# Altium project MOD-COIL-LN2-21.PrjPCB (part 3 of 4)

## Sheet Power_Stage.SchDoc: Power Stage
size A3; Author: M.Beldyga; CompanyName: WUT ISE; DrawnBy: M.Beldyga; Organization: WUT ISE; Address1: PW ISE; Address2: Nowowiejska 15/19 00-665 Warsaw; Address3: micbeldyga@gmail.com; SheetNumber: 6; SheetTotal: 9; ModifiedBy: -; CheckedDate: -; DivGrp: WUT ISE; Designer: GK, MB; ModifiedDate: -; ProjectName: Sensor Box
Used 2 times, as channels U_Power_Stage, U_Power_Stage. Parts and nets are listed once, with the designators drawn on the sheet.
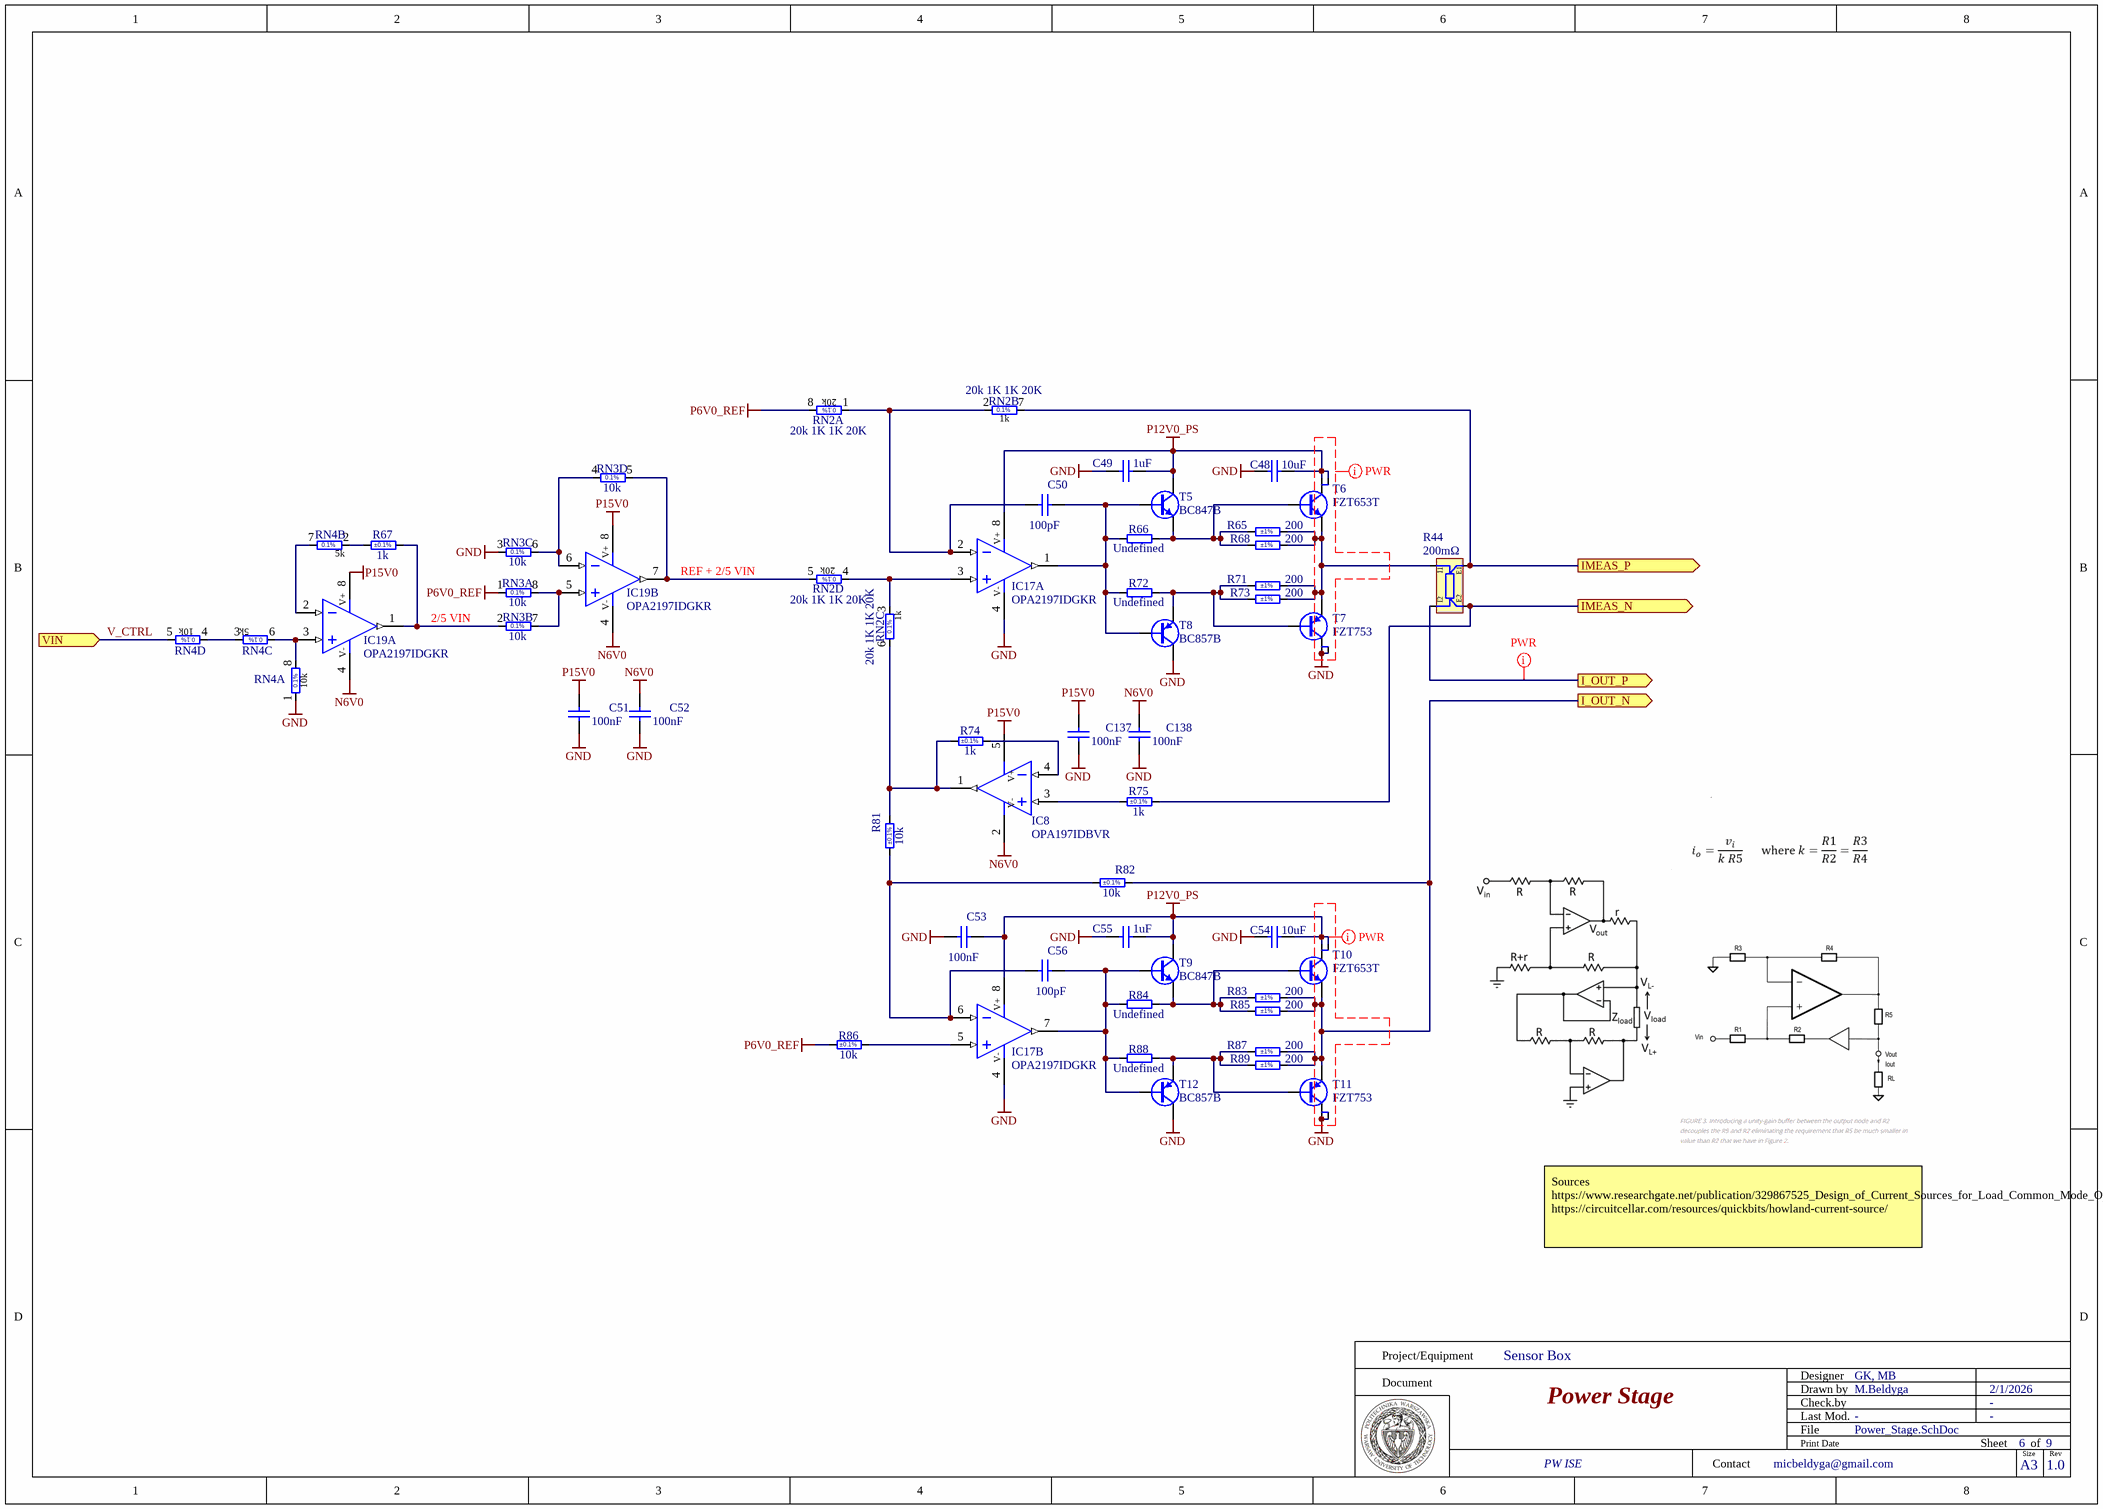
[diagram p5: Power_Stage.SchDoc]

### Parts
C48  10uF  [CAPC2012X95N]
C49  1uF  [CAPC1608X87N]
C50  100pF  [CAPC1005X55N]
C51  100nF  [CAPC1005X55N]
C52  100nF  [CAPC1005X55N]
C53  100nF  [CAPC1005X55N]
C54  10uF  [CAPC2012X95N]
C55  1uF  [CAPC1608X87N]
C56  100pF  [CAPC1005X55N]
C137  100nF  [CAPC1005X55N]
C138  100nF  [CAPC1005X55N]
IC8  OPA197IDBVR  [SOT95P280X145-5N]
IC17  OPA2197IDGKR  [SOP65P490X110-8N]  (parts A,B of 2)
IC19  OPA2197IDGKR  [SOP65P490X110-8N]  (parts A,B of 2)
R44  200mΩ  [RES_VISHAY_CSM2512_0R007-0R2]
R65  200  Tolerance: ±1%  [RESC1608X55N]
R66  Undefined  [RESC1608X55N]
R67  1k  Tolerance: ±0.1%  [RESC1005X40N]
R68  200  Tolerance: ±1%  [RESC1608X55N]
R71  200  Tolerance: ±1%  [RESC1608X55N]
R72  Undefined  [RESC1608X55N]
R73  200  Tolerance: ±1%  [RESC1608X55N]
R74  1k  Tolerance: ±0.1%  [RESC1005X40N]
R75  1k  Tolerance: ±0.1%  [RESC1005X40N]
R81  10k  Tolerance: ±0.1%  [RESC1005X35N]
R82  10k  Tolerance: ±0.1%  [RESC1005X35N]
R83  200  Tolerance: ±1%  [RESC1608X55N]
R84  Undefined  [RESC1608X55N]
R85  200  Tolerance: ±1%  [RESC1608X55N]
R86  10k  Tolerance: ±0.1%  [RESC1005X35N]
R87  200  Tolerance: ±1%  [RESC1608X55N]
R88  Undefined  [RESC1608X55N]
R89  200  Tolerance: ±1%  [RESC1608X55N]
RN2  20k 1K 1K 20K  [SOIC127P600X175-8N]  (parts A,B,C,D of 4)
RN3  10k  [SOIC127P600X175-8N]  (parts A,B,C,D of 4)
RN4  10k 5K 5K 10K  [SOIC127P600X175-8N]  (value not drawn)  (parts A,B,C,D of 4)
T5  BC847B  [SOT95P230X110-3N]
T6  FZT653T  [SOT230P700X180-4N]
T7  FZT753  [SOT230P700X180-4N]
T8  BC857B  [SOT95P230X110-3N]
T9  BC847B  [SOT95P230X110-3N]
T10  FZT653T  [SOT230P700X180-4N]
T11  FZT753  [SOT230P700X180-4N]
T12  BC857B  [SOT95P230X110-3N]

### Ports
I_OUT_N (out), I_OUT_P (out), IMEAS_N (out), IMEAS_P (out), VIN (in)

### Nets
GND: C48.2 C49.1 C51.1 C52.1 C53.1 C54.2 C55.1 C137.1 C138.1 IC17.4(V-) RN3.3 RN4.1 T7.2(C) T7.4(C) T8.3(C) T11.2(C) T11.4(C) T12.3(C)
N6V0: C52.2 C138.2 IC8.2(V-) IC19.4(V-)
P6V0_REF: R86.1 RN2.8 RN3.1
P12V0_PS: C48.1 C49.2 C53.2 C54.1 C55.2 IC17.8(V+) T5.3(C) T6.2(C) T6.4(C) T9.3(C) T10.2(C) T10.4(C)
P15V0: C51.2 C137.2 IC8.5(V+) IC19.8(V+)
I_OUT_N: R82.2 R83.2 R85.2 R87.2 R89.2 T10.3(E) T11.3(E) ; port I_OUT_N
I_OUT_P: R44.I2 ; port I_OUT_P
IMEAS_N: R44.E2 R75.2 ; port IMEAS_N
IMEAS_P: R44.E1 RN2.7 ; port IMEAS_P
V_CTRL: RN4.5 ; port VIN
NetC50_1: C50.1 IC17.2(IN-) RN2.1 RN2.2
NetC50_2: C50.2 IC17.1(OUT) R66.1 R72.1 T5.1(B) T8.1(B)
NetC56_1: C56.1 IC17.6(IN-) R81.1 R82.1
NetC56_2: C56.2 IC17.7(OUT) R84.1 R88.1 T9.1(B) T12.1(B)
NetIC8_1: IC8.1(OUT) R74.1 R81.2 RN2.6
NetIC8_3: IC8.3(IN+) R75.1
NetIC8_4: IC8.4(IN-) R74.2
NetIC17_3: IC17.3(IN+) RN2.3 RN2.4
NetIC17_5: IC17.5(IN+) R86.2
NetIC19_1: IC19.1(OUT) R67.2 RN3.2
NetIC19_2: IC19.2(IN-) RN4.7
NetIC19_3: IC19.3(IN+) RN4.6 RN4.8
NetIC19_5: IC19.5(IN+) RN3.7 RN3.8
NetIC19_6: IC19.6(IN-) RN3.4 RN3.6
NetIC19_7: IC19.7(OUT) RN2.5 RN3.5
NetR44_I1: R44.I1 R65.2 R68.2 R71.2 R73.2 T6.3(E) T7.3(E)
NetR65_1: R65.1 R66.2 R68.1 T5.2(E) T6.1(B)
NetR67_1: R67.1 RN4.2
NetR71_1: R71.1 R72.2 R73.1 T7.1(B) T8.2(E)
NetR83_1: R83.1 R84.2 R85.1 T9.2(E) T10.1(B)
NetR87_1: R87.1 R88.2 R89.1 T11.1(B) T12.2(E)
NetRN4_3: RN4.3 RN4.4

### Channels
U_Power_Stage: designators end in A; ports I_OUT_N=CH0_OUT_N I_OUT_P=CH0_OUT_P IMEAS_N=CH0_IMEAS_N IMEAS_P=CH0_IMEAS_P VIN=V_CTRL
U_Power_Stage: designators end in B; ports I_OUT_N=CH1_OUT_N I_OUT_P=CH1_OUT_P IMEAS_N=CH1_IMEAS_N IMEAS_P=CH1_IMEAS_P VIN=V_CTRL

### Layout directives
net class PWR: CH0_OUT_P, GND, P12V0_PS

### Notes on the sheet
- REF + 2/5 VIN
- (near RN3) 2/5 VIN
- Sources https://www.researchgate.net/publication/329867525_Design_of_Current_Sources_for_Load_Common_Mode_Optimization/figures?lo=1
  https://circuitcellar.com/resources/quickbits/howland-current-source/
- Project/Equipment
- Document
- Designer
- Drawn by
- Check.by
- Contact
- File
- Last Mod.
- Print Date
- Sheet
- Size
- A3
- of
- Rev
- (in symbol RN_10K_5K_VISHAY_AORN2-1AT3, part A) 10k
- (in symbol RN_10K_5K_VISHAY_AORN2-1AT3, part B) 5k
- (in symbol RN_10K_5K_VISHAY_AORN2-1AT3, part C) 5k
- (in symbol RN_10K_5K_VISHAY_AORN2-1AT3, part D) 10k
- (in symbol RN_20K_1K_VISHAY_AORN20-1A, part A) 20k
- (in symbol RN_20K_1K_VISHAY_AORN20-1A, part B) 1k
- (in symbol RN_20K_1K_VISHAY_AORN20-1A, part C) 1k
- (in symbol RN_20K_1K_VISHAY_AORN20-1A, part D) 20k

### Library data of the parts
C48 C54 = CC0805_10UF_25V_10%_X5R: Non-polarised capacitor; Part Description: SMD Multilayer Chip Ceramic Capacitor; Manufacturer: GENERIC; Manufacturer1 Part Number: GRM21BR61E106KA73L; Voltage: 25V; TC: X5R; Tolerance: ±10%; Part Number: CC0805_10UF_25V_10%_X5R; Component Kind: Standard; Component Type: Standard; Pin Count: 2; Value: 10uF; Status: Preferred; Manufacturer Part Number: CC0805_10UF_25V_10%_X5R; Case: 0805; Mounted: Yes; Socket: No; SMD: Yes; Sense: No; Manufacturer1 Example: MURATA; Manufacturer1 ComponentHeight: 0.95mm; HelpURL: \\cern.ch\dfs\Applications\Altium\Datasheets\CC0805_X5R_MURATA_GRM.pdf; Author: CERN DEM JLC; CreateDate: 25.10.2012; LatestRevisionDate: 06.09.2016
C49 C55 = CC0603_1UF_25V_10%_X7R: Non-polarised capacitor; Part Description: SMD Multilayer Chip Ceramic Capacitor; Manufacturer: GENERIC; Manufacturer1 Part Number: GCM188R71E105KA64D; Voltage: 25V; TC: X7R; Tolerance: ±10%; Part Number: CC0603_1UF_25V_10%_X7R; Component Kind: Standard; Component Type: Standard; Pin Count: 2; Value: 1uF; Status: None; Manufacturer Part Number: CC0603_1UF_25V_10%_X7R; Case: 0603; Mounted: Yes; Socket: No; SMD: Yes; Sense: No; Manufacturer1 Example: MURATA; Manufacturer1 ComponentHeight: 0.9mm; HelpURL: \\cern.ch\dfs\Applications\Altium\Datasheets\CC0603_X7R_MURATA.pdf; Author: CERN DEM JLC; CreateDate: 18.01.2011; LatestRevisionDate: 18.01.2011
C50 C56 = CC0402_100PF_50V_5%_C0G: Non-polarised capacitor; Part Description: SMD Multilayer Chip Ceramic Capacitor; Manufacturer: GENERIC; Manufacturer1 Part Number: C0402C101J5GACTU; Voltage: 50V; TC: C0G/NP0; Tolerance: ±5%; Part Number: CC0402_100PF_50V_5%_C0G; Component Kind: Standard; Component Type: Standard; Pin Count: 2; Value: 100pF; Status: Preferred; Manufacturer Part Number: CC0402_100PF_50V_5%_C0G; Case: 0402; Mounted: Yes; Socket: No; SMD: Yes; Sense: No; Manufacturer1 Example: KEMET; Manufacturer1 ComponentHeight: 0.55mm; HelpURL: \\cern.ch\dfs\Applications\Altium\Datasheets\CC0402_C0G_KEMET_(Commercial Grade).pdf; Author: CERN DEM JLC; CreateDate: 12/3/2007; LatestRevisionDate: 4/22/2015
C51-C53 C137 C138 = CC0402_100NF_16V_10%_X5R: Non-polarised capacitor; Part Description: SMD Multilayer Chip Ceramic Capacitor; Manufacturer: GENERIC; Manufacturer1 Part Number: GRM155R61C104KA88D; Voltage: 16V; TC: X5R; Tolerance: ±10%; Part Number: CC0402_100NF_16V_10%_X5R; Component Kind: Standard; Component Type: Standard; Pin Count: 2; Value: 100nF; Status: None; Manufacturer Part Number: CC0402_100NF_16V_10%_X5R; Case: 0402; Mounted: Yes; Socket: No; SMD: Yes; Sense: No; Manufacturer1 Example: MURATA; Manufacturer1 ComponentHeight: 0.55mm; HelpURL: \\cern.ch\dfs\Applications\Altium\Datasheets\CC0402_X5R_MURATA_GRM.pdf; Author: CERN DEM JLC; CreateDate: 10.12.2013; LatestRevisionDate: 10.12.2013
IC8 = OPA197IDBVR: Op Amp Single Precision Amplifier R-R I/O ±18V/36V 5-Pin SOT-23 T/R; Manufacturer: Texas Instruments; Manufacturer Lifecycle Status: ACTIVE; Gain Bandwidth Product: 10MHz; Input Bias Current: 5pA; Input Offset Voltage (Vos): 25µV; Number of Channels: 1; Operating Supply Current: 1mA; Output Current per Channel: 65mA; Slew Rate: 20V/µs; Supplier: DigiKey; Supplier Part Number: 296-47813-6-ND; Manufacturer Part Number: OPA197IDBVR; RoHS: Compliant; Category: Amplifiers - Op Amps, Buffer, Instrumentation; Pricing: 1=1.71, 10=1.254, 25=1.1404, 100=1.0149, 250=0.95512, 500=0.9191, 1000=0.88942 (USD); Case/Package: SOT-23; Height: 1.45mm; Lead Free: Lead Free; Length: 2.9mm; Lifecycle Status: Production; Max Operating Temperature: 125°C; Min Operating Temperature: -40°C; Mounting Technology: Surface Mount; Number of Circuits: 1; Pins: 5; Schedule B: 8542330000, 8542330000|8542330000|8542330000|8542330000|8542330000|8542330000|8542330000|8542330000|8542330000|8542330000|8542330000|8542330000|8542330000|8542330000|8542330000|8542330000|8542330000|8542330000|8542330000|8542330000|8542330000|8542330000|8542330000|85; Thickness: 1.2mm; Width: 1.6mm; ComponentLink1URL: https://sigma.octopart.com:443/177332311/technical_drawing/Texas-Instruments-OPA197IDBVR.pdf?src-supplier=Texas+Instruments; ComponentLink1Description: https://sigma.octopart.com:443/177332311/technical_drawing/Texas-Instruments-OPA197IDBVR.pdf?src-supplier=Texas+Instruments; ComponentLink2URL: https://octopart.com:443/opatz8j6/c1?t=Q1P8Bdc4KgCCbFqp7UlYpcJ8AhpVpiPIEDSj71pxBcZVcsUhmuEmpKuLfuswML2SqYTIjZ0KbZTePt0BTa5L0Ib-QO4qx2Pc4AGXPK19iWgmTvAzROBybWvsv8SVdmbKXcfVjzYF5gNG51bfmeDdyG8TPrSMEhnU0XxyolWqRvFZRm1lt3I32W7t_wfMxmeR34edfRjLHyyRFXxPyflRs4eg4WP07F8bmt6pOKmN-USMuy6Faze7x22RpNONDH4EojWIvEjwq6_wS8mD7vZGVP7z7Ngk7vArTcyRg02zIl199DZ1b6QvO1RGY5iVnJ8IHDniUbpBX1tObbv_cSSRQlS6KVLtLLjRXr4EmXhu9GKtw9wXk68tfrl34suuqK6ened5hg&src-supplier=Texas+Instruments; ComponentLink2Description: https://octopart.com:443/opatz8j6/c1?t=Q1P8Bdc4KgCCbFqp7UlYpcJ8AhpVpiPIEDSj71pxBcZVcsUhmuEmpKuLfuswML2SqYTIjZ0KbZTePt0BTa5L0Ib-QO4qx2Pc4AGXPK19iWgmTvAzROBybWvsv8SVdmbKXcfVjzYF5gNG51bfmeDdyG8TPrSMEhnU0XxyolWqRvFZRm1lt3I32W7t_wfMxmeR34edfRjLHyyRFXxPyflRs4eg4WP07F8bmt6pOKmN-USMuy6Faze7x22RpNONDH4EojWIvEjwq6_wS8mD7vZGVP7z7Ngk7vArTcyRg02zIl199DZ1b6QvO1RGY5iVnJ8IHDniUbpBX1tObbv_cSSRQlS6KVLtLLjRXr4EmXhu9GKtw9wXk68tfrl34suuqK6ened5hg&src-supplier=Texas+Instruments; ComponentLink3URL: https://sigma.octopart.com:443/175570406/technical_drawing/Texas-Instruments-OPA197IDBVR.pdf?src-supplier=Texas+Instruments; ComponentLink3Description: https://sigma.octopart.com:443/175570406/technical_drawing/Texas-Instruments-OPA197IDBVR.pdf?src-supplier=Texas+Instruments; ComponentLink4URL: https://sigma.octopart.com:443/169406034/technical_drawing/Texas-Instruments-OPA197IDBVR.pdf?src-supplier=Texas+Instruments; ComponentLink4Description: https://sigma.octopart.com:443/169406034/technical_drawing/Texas-Instruments-OPA197IDBVR.pdf?src-supplier=Texas+Instruments; ComponentLink5URL: https://sigma.octopart.com:443/155939316/technical_drawing/Texas-Instruments-OPA197IDBVR.pdf?src-supplier=Texas+Instruments; ComponentLink5Description: https://sigma.octopart.com:443/155939316/technical_drawing/Texas-Instruments-OPA197IDBVR.pdf?src-supplier=Texas+Instruments; ComponentLink6URL: https://sigma.octopart.com:443/102331370/technical_drawing/Texas-Instruments-OPA197IDBVR.pdf?src-supplier=Texas+Instruments; ComponentLink6Description: https://sigma.octopart.com:443/102331370/technical_drawing/Texas-Instruments-OPA197IDBVR.pdf?src-supplier=Texas+Instruments; ComponentLink7URL: https://datasheet.octopart.com:443/OPA197IDBVR-Texas-Instruments-datasheet-62062805.pdf?src-supplier=Texas+Instruments; ComponentLink7Description: https://datasheet.octopart.com:443/OPA197IDBVR-Texas-Instruments-datasheet-62062805.pdf?src-supplier=Texas+Instruments; ComponentLink8URL: https://sigma.octopart.com:443/49249325/technical_drawing/Texas-Instruments-OPA197IDBVR.pdf?src-supplier=Texas+Instruments; ComponentLink8Description: https://sigma.octopart.com:443/49249325/technical_drawing/Texas-Instruments-OPA197IDBVR.pdf?src-supplier=Texas+Instruments; ComponentLink9URL: https://datasheet.octopart.com:443/OPA197IDBVR-Texas-Instruments-datasheet-164361763.pdf?src-supplier=SHENGYU+ELECTRONICS; ComponentLink9Description: https://datasheet.octopart.com:443/OPA197IDBVR-Texas-Instruments-datasheet-164361763.pdf?src-supplier=SHENGYU+ELECTRONICS; ComponentLink10URL: https://datasheet.octopart.com:443/OPA197IDBVR-Texas-Instruments-datasheet-165804228.pdf?src-supplier=LCSC; ComponentLink10Description: https://datasheet.octopart.com:443/OPA197IDBVR-Texas-Instruments-datasheet-165804228.pdf?src-supplier=LCSC; ComponentLink11URL: https://datasheet.octopart.com:443/OPA197IDBVR-Texas-Instruments-datasheet-159115560.pdf?src-supplier=LCSC; ComponentLink11Description: https://datasheet.octopart.com:443/OPA197IDBVR-Texas-Instruments-datasheet-159115560.pdf?src-supplier=LCSC; ComponentLink12URL: https://datasheet.octopart.com:443/OPA197IDBVR-Texas-Instruments-datasheet-140571582.pdf?src-supplier=Arrow.cn; ComponentLink12Description: https://datasheet.octopart.com:443/OPA197IDBVR-Texas-Instruments-datasheet-140571582.pdf?src-supplier=Arrow.cn; ComponentLink13URL: https://datasheet.octopart.com:443/OPA197IDBVR-Texas-Instruments-datasheet-137316104.pdf?src-supplier=Future+Electronics; ComponentLink13Description: https://datasheet.octopart.com:443/OPA197IDBVR-Texas-Instruments-datasheet-137316104.pdf?src-supplier=Future+Electronics; ComponentLink14URL: http://sigma.octopart.com:80/reach_statement/Texas-Instruments-company-64.pdf?src-supplier=Compliance+Statements; ComponentLink14Description: http://sigma.octopart.com:80/reach_statement/Texas-Instruments-company-64.pdf?src-supplier=Compliance+Statements; ComponentLink15URL: http://sigma.octopart.com:80/conflict_mineral_statement/Texas-Instruments-company-63.pdf?src-supplier=Compliance+Statements; ComponentLink15Description: http://sigma.octopart.com:80/conflict_mineral_statement/Texas-Instruments-company-63.pdf?src-supplier=Compliance+Statements
IC17 IC19 = OA_OPA2197IDGKR: 36-V, Precision, Rail-to-Rail Input Output, Low Offset Voltage Op Amp 8-VSSOP; Part Description: High-Precision, Low-Noise, Rail-to-Rail Output,10-MHz Op Amp; Manufacturer1: TEXAS INSTRUMENTS; PressFit: No; Bonding: No; Part Number: OPA2197IDGKR; Component Kind: Standard; Component Type: Standard; Device: OPA2197IDGKR; PackageDescription: SOP, 0.65mm pitch; 8 pin, 3.00mm W X 3.00mm L X 1.10mm H body, IPC Medium Density; Manufacturer1 Part Number: OPA2197IDGKR; Pin Count: 8; Case: MSOP8; Mounted: Yes; Socket: No; SMD: Yes; Sense: No; ComponentHeight: 1.1mm; Author: GK; HelpURL: \\cern.ch\dfs\Applications\Altium\Datasheets\OPA2140AIDGK.pdf; CreateDate: 20.04.2017; LatestRevisionDate: 20.04.2017
R44 = Y14870R20000B9R: Fixed Resistor, Metal Strip, 1W, 0.2ohm, 0.447V, 0.1% +/-Tol, 15ppm/Cel, Surface Mount, 2512; Manufacturer: VPG Foil Resistors; Temperature Coefficient: 15ppm/°C; Working Voltage: 447mV; Supplier: DigiKey; Supplier Part Number: 804-Y14870R20000B9RCT-ND; Manufacturer Part Number: Y14870R20000B9R; RoHS: Compliant; Category: Chip SMD Resistors; Stock: 1352; Pricing: 1=12.8, 10=8.918, 25=7.8692, 50=7.2126, 100=6.6548, 250=6.25768 (USD); Case/Package: 2512; Case Code (Imperial): 2512; Case Code (Metric): 6432; Composition: Metal Foil; Features: Moisture Resistant; Height: 635µm; Length: 6.35mm; Lifecycle Status: Production; Max Operating Temperature: 170°C; Max Power Dissipation: 1W; Min Operating Temperature: -65°C; Mounting Technology: Surface Mount; Number of Terminals: 2; Number of Terminations: 4; Packaging: Tape & Reel (TR); Power Dissipation: 1W; REACH SVHC: Yes; Value: 200mΩ; Tolerance: 0.1%; Width: 3.175mm; ComponentLink1URL: https://datasheet.octopart.com:443/Y14870R20000B9R-Vishay-Precision-Group-datasheet-182188787.pdf?src-supplier=IHS; ComponentLink1Description: https://datasheet.octopart.com:443/Y14870R20000B9R-Vishay-Precision-Group-datasheet-182188787.pdf?src-supplier=IHS; ComponentLink2URL: https://datasheet.octopart.com:443/Y14870R20000B9R-VPG-Foil-Resistors-datasheet-182027518.pdf?src-supplier=IHS; ComponentLink2Description: https://datasheet.octopart.com:443/Y14870R20000B9R-VPG-Foil-Resistors-datasheet-182027518.pdf?src-supplier=IHS
R65 R68 R71 R73 R83 R85 R87 R89 = R0603_200R_1%_0.1W_100PPM: Resistor - 1%; Part Description: General Purpose Thick Film Chip Resistor; Manufacturer: GENERIC; Manufacturer1: Vishay; Manufacturer1 Part Number: CRCW0603200RFKEA; Power: 0.1W; TC: ±100ppm/°C; PressFit: No; Part Number: R0603_200R_1%_0.1W_100PPM; Component Kind: Standard; Component Type: Standard; Pin Count: 2; Value: 200; Status: Preferred; Manufacturer Part Number: R0603_200R_1%_0.1W_100PPM; Case: 0603; Mounted: Yes; Sense: No; Socket: No; SMD: Yes; Manufacturer1 ComponentHeight: 0.55mm; HelpURL: \\cern.ch\dfs\Applications\Altium\Datasheets\R0603_NIC_NRC.pdf; Author: CERN DEM JLC; CreateDate: 03.12.2007; LatestRevisionDate: 13.03.2008
R66 R72 R84 R88 = R0603_NO-VALUE: Resistor; Part Description: Reserved Footprint For a 0603 (1608) Chip Resistor; PressFit: No; Mounted: No; Part Number: R0603_NO-VALUE; Component Kind: Standard; Component Type: Standard; Pin Count: 2; Value: Undefined; Status: None; Manufacturer: Undefined; Manufacturer Part Number: R0603_NO-VALUE; Case: 0603; Sense: No; Socket: No; SMD: Yes; Manufacturer1 Example: Undefined; Manufacturer1 Part Number: Undefined; Manufacturer1 ComponentHeight: Undefined; HelpURL: Undefined; Author: CERN DEM JLC; CreateDate: 03.12.2007; LatestRevisionDate: 13.03.2008
R67 R74 R75 = R0402_1K_0.1%_0.063W_25PPM: Resistor - 0.1%; Part Description: Thin Film Precision Resistor; Manufacturer: GENERIC; Manufacturer1 Part Number: ERA2AEB102X; Power: 0.063W; TC: ±25ppm/°C; PressFit: No; Voltage: 50V; Part Number: R0402_1K_0.1%_0.063W_25PPM; Component Kind: Standard; Component Type: Standard; Pin Count: 2; Value: 1k; Status: Not Recommended; Manufacturer Part Number: R0402_1K_0.1%_0.063W_25PPM; Case: 0402; Mounted: Yes; Sense: No; Socket: No; SMD: Yes; Manufacturer1 ComponentHeight: 0.4mm; HelpURL: \\cern.ch\dfs\Applications\Altium\Datasheets\R0402_PANASONIC_ERA.pdf; Author: CERN DEM BC; CreateDate: 7/10/2020; LatestRevisionDate: 7/10/2020; Manufacturer1 Example: PANASONIC
R81 R82 R86 = R0402_10K_0.1%_0.063W_25PPM: Resistor - 0.1%; Part Description: Thin Film Precision Resistor; Manufacturer: GENERIC; Manufacturer1 Part Number: CPF0402B10KE1; Power: 0.063W; TC: ±25ppm/°C; PressFit: No; Part Number: R0402_10K_0.1%_0.063W_25PPM; Component Kind: Standard; Component Type: Standard; Pin Count: 2; Value: 10k; Status: Not Recommended; Manufacturer Part Number: R0402_10K_0.1%_0.063W_25PPM; Case: 0402; Mounted: Yes; Sense: No; Socket: No; SMD: Yes; Manufacturer1 ComponentHeight: 0.35mm; HelpURL: \\cern.ch\dfs\Applications\Altium\Datasheets\R0402_TYCO_CPF.pdf; Author: CERN DEM JMW; CreateDate: 9/22/2015; LatestRevisionDate: 9/22/2015; Manufacturer1 Example: TE CONNECTIVITY
RN2 = RN_20K_1K_VISHAY_AORN20-1A: DIL8 Resistor Network 4 Resistors 4xR 10k-1k-1k-10k 0.1%; Part Number: RN_20K_1K_VISHAY_AORN10-1A; Part Description: Dual-In-Line Thin Film Precision Automotive Resistors Network, (4 Isolated) - AORN Series; Manufacturer1: VISHAY DALE; Manufacturer1 Part Number: AORN20-1AT5; Power: 4x0.1W; TC: ±25ppm/°C; PressFit: No; Component Kind: Standard; Component Type: Standard; Pin Count: 8; Value: 20k 1K 1K 20K; Sense: No; Tolerance: 0.1%; Case: SOIC8; Mounted: Yes; Socket: No; SMD: Yes; ComponentHeight: 1.73mm; HelpURL: \\cern.ch\dfs\Applications\Altium\Datasheets\RN_VISHAY_AORN.pdf; Author: GK; CreateDate: 20.02.2017; LatestRevisionDate: 15.01.2020
RN3 = RN_10K_VISHAY_AORN1002A: DIL8 Resistor Network 4 Isolated Resistor 0.1%; Part Description: Dual-In-Line Thin Film Precision Automotive Resistors Network, (4 Isolated) - AORN Series; Manufacturer1: VISHAY DALE; Manufacturer1 Part Number: AORN1002AT5; Power: 4x0.1W; TC: ±25ppm/°C; PressFit: No; Part Number: RN_10K_VISHAY_AORN1002A; Component Kind: Standard; Component Type: Standard; Pin Count: 8; Value: 10k; Sense: No; Tolerance: 0.1%; Case: SOIC8; Mounted: Yes; Socket: No; SMD: Yes; ComponentHeight: 1.73mm; HelpURL: \\cern.ch\dfs\Applications\Altium\Datasheets\RN_VISHAY_AORN.pdf; Author: CERN DEM JLC; CreateDate: 20.02.2017; LatestRevisionDate: 03.05.2017
RN4 = RN_10K_5K_VISHAY_AORN2-1AT3: DIL8 Resistor Network 4 Resistors 10k-5k-5k-10k 0.1%; Part Description: Dual-In-Line Thin Film Precision Automotive Resistors Network, (4 Isolated) - AORN Series; Manufacturer1: VISHAY DALE; Manufacturer1 Part Number: AORN2-1AT5; Power: 4x0.1W; TC: ±25ppm/°C; PressFit: No; Part Number: RN_10K_5K_VISHAY_AORN2-1AT3; Component Kind: Standard; Component Type: Standard; Pin Count: 8; Value: 10k 5K 5K 10K; Sense: No; Tolerance: 0.1%; Case: SOIC8; Mounted: Yes; Socket: No; SMD: Yes; ComponentHeight: 1.73mm; HelpURL: \\cern.ch\dfs\Applications\Altium\Datasheets\RN_VISHAY_AORN.pdf; Author: CERN DEM JLC; CreateDate: 20.02.2017; LatestRevisionDate: 20.02.2017
T5 T9 = BC847B: NPN Transistor; Part Description: 45V 100mA NPN General-Purpose Transistor; Manufacturer: NXP SEMICONDUCTORS; PressFit: No; Bonding: No; Part Number: BC847B; Component Kind: Standard; Component Type: Standard; Device: BC847B; PackageDescription: SOT23, 0.95mm Pitch; 3 Pin, 1.30mm W X 2.90mm L X 1.10mm H body, IPC Medium Density; Manufacturer Part Number: BC847B; Pin Count: 3; Case: SOT23-3; Mounted: Yes; Socket: No; SMD: Yes; Sense: No; ComponentHeight: 1.1mm; HelpURL: \\cern.ch\dfs\Applications\Altium\Datasheets\BC847B.pdf; Author: CERN DEM JLC; CreateDate: 6/14/2011; LatestRevisionDate: 6/14/2011
T6 T10 = FZT653T: NPN Transistor; Part Description: 60 To 100V, 2A, NPN Silicon Planar Medium Power High gain Transistor; Manufacturer: ZETEX SEMICONDUCTORS; PressFit: No; Bonding: No; Part Number: FZT653T; Component Kind: Standard; Component Type: Standard; Device: FZT653T; PackageDescription: SOT223, 2.30mm Pitch; 4 Pin, 3.70mm W X 6.70mm L X 1.80mm H body, IPC Medium Density; Manufacturer Part Number: FZT653T; Pin Count: 4; Case: SOT223; Mounted: Yes; Socket: No; SMD: Yes; Sense: No; ComponentHeight: 1.8mm; HelpURL: \\cern.ch\dfs\Applications\Altium\Datasheets\FZT653T.pdf; Author: CERN DEM HF; CreateDate: 4/22/2022; LatestRevisionDate: 4/22/2022
T7 T11 = FZT753: PNP Transistor; Part Description: 60V, 5A, PNP Silicon Planar High Current Transistor; Manufacturer: DIODES INCORPORATED; PressFit: No; Bonding: No; Part Number: FZT753; Component Kind: Standard; Component Type: Standard; Device: FZT753; PackageDescription: SOT223, 2.30mm Pitch; 4 Pin, 3.70mm W X 6.70mm L X 1.80mm H body, IPC Medium Density; Manufacturer Part Number: FZT753; Pin Count: 4; Case: SOT223; Mounted: Yes; Socket: No; SMD: Yes; Sense: No; ComponentHeight: 1.8mm; HelpURL: \\cern.ch\dfs\Applications\Altium\Datasheets\FZT753.pdf; Author: CERN DEM JLC; CreateDate: 8/19/2014; LatestRevisionDate: 8/19/2014
T8 T12 = BC857B: PNP Transistor; Part Description: -45V -100mA PNP General-Purpose Transistors; Manufacturer: NXP SEMICONDUCTORS; PressFit: No; Bonding: No; Part Number: BC857B; Component Kind: Standard; Component Type: Standard; Device: BC857B; PackageDescription: SOT23, 0.95mm Pitch; 3 Pin, 1.30mm W X 2.90mm L X 1.10mm H body, IPC Medium Density; Manufacturer Part Number: BC857B; Pin Count: 3; Case: SOT23-3; Mounted: Yes; Socket: No; SMD: Yes; Sense: No; ComponentHeight: 1.1mm; HelpURL: \\cern.ch\dfs\Applications\Altium\Datasheets\BC857B.pdf; Author: CERN DEM JLC; CreateDate: 6/14/2011; LatestRevisionDate: 6/14/2011

## Sheet Booster_con.SchDoc: DisplayPort
size A3; Author: M.Beldyga; CompanyName: WUT ISE; DrawnBy: M.Beldyga; Organization: WUT ISE; Address1: PW ISE; Address2: Nowowiejska 15/19 00-665 Warsaw; Address3: micbeldyga@gmail.com; SheetNumber: 7; SheetTotal: 9; ModifiedBy: -; CheckedDate: -; Title2: Booster connector; DivGrp: WUT ISE; Designer: M.Beldyga; ModifiedDate: -; ProjectName: Sensor Box
Used 2 times, as channels U_Booster_con, U_Booster_con. Parts and nets are listed once, with the designators drawn on the sheet.
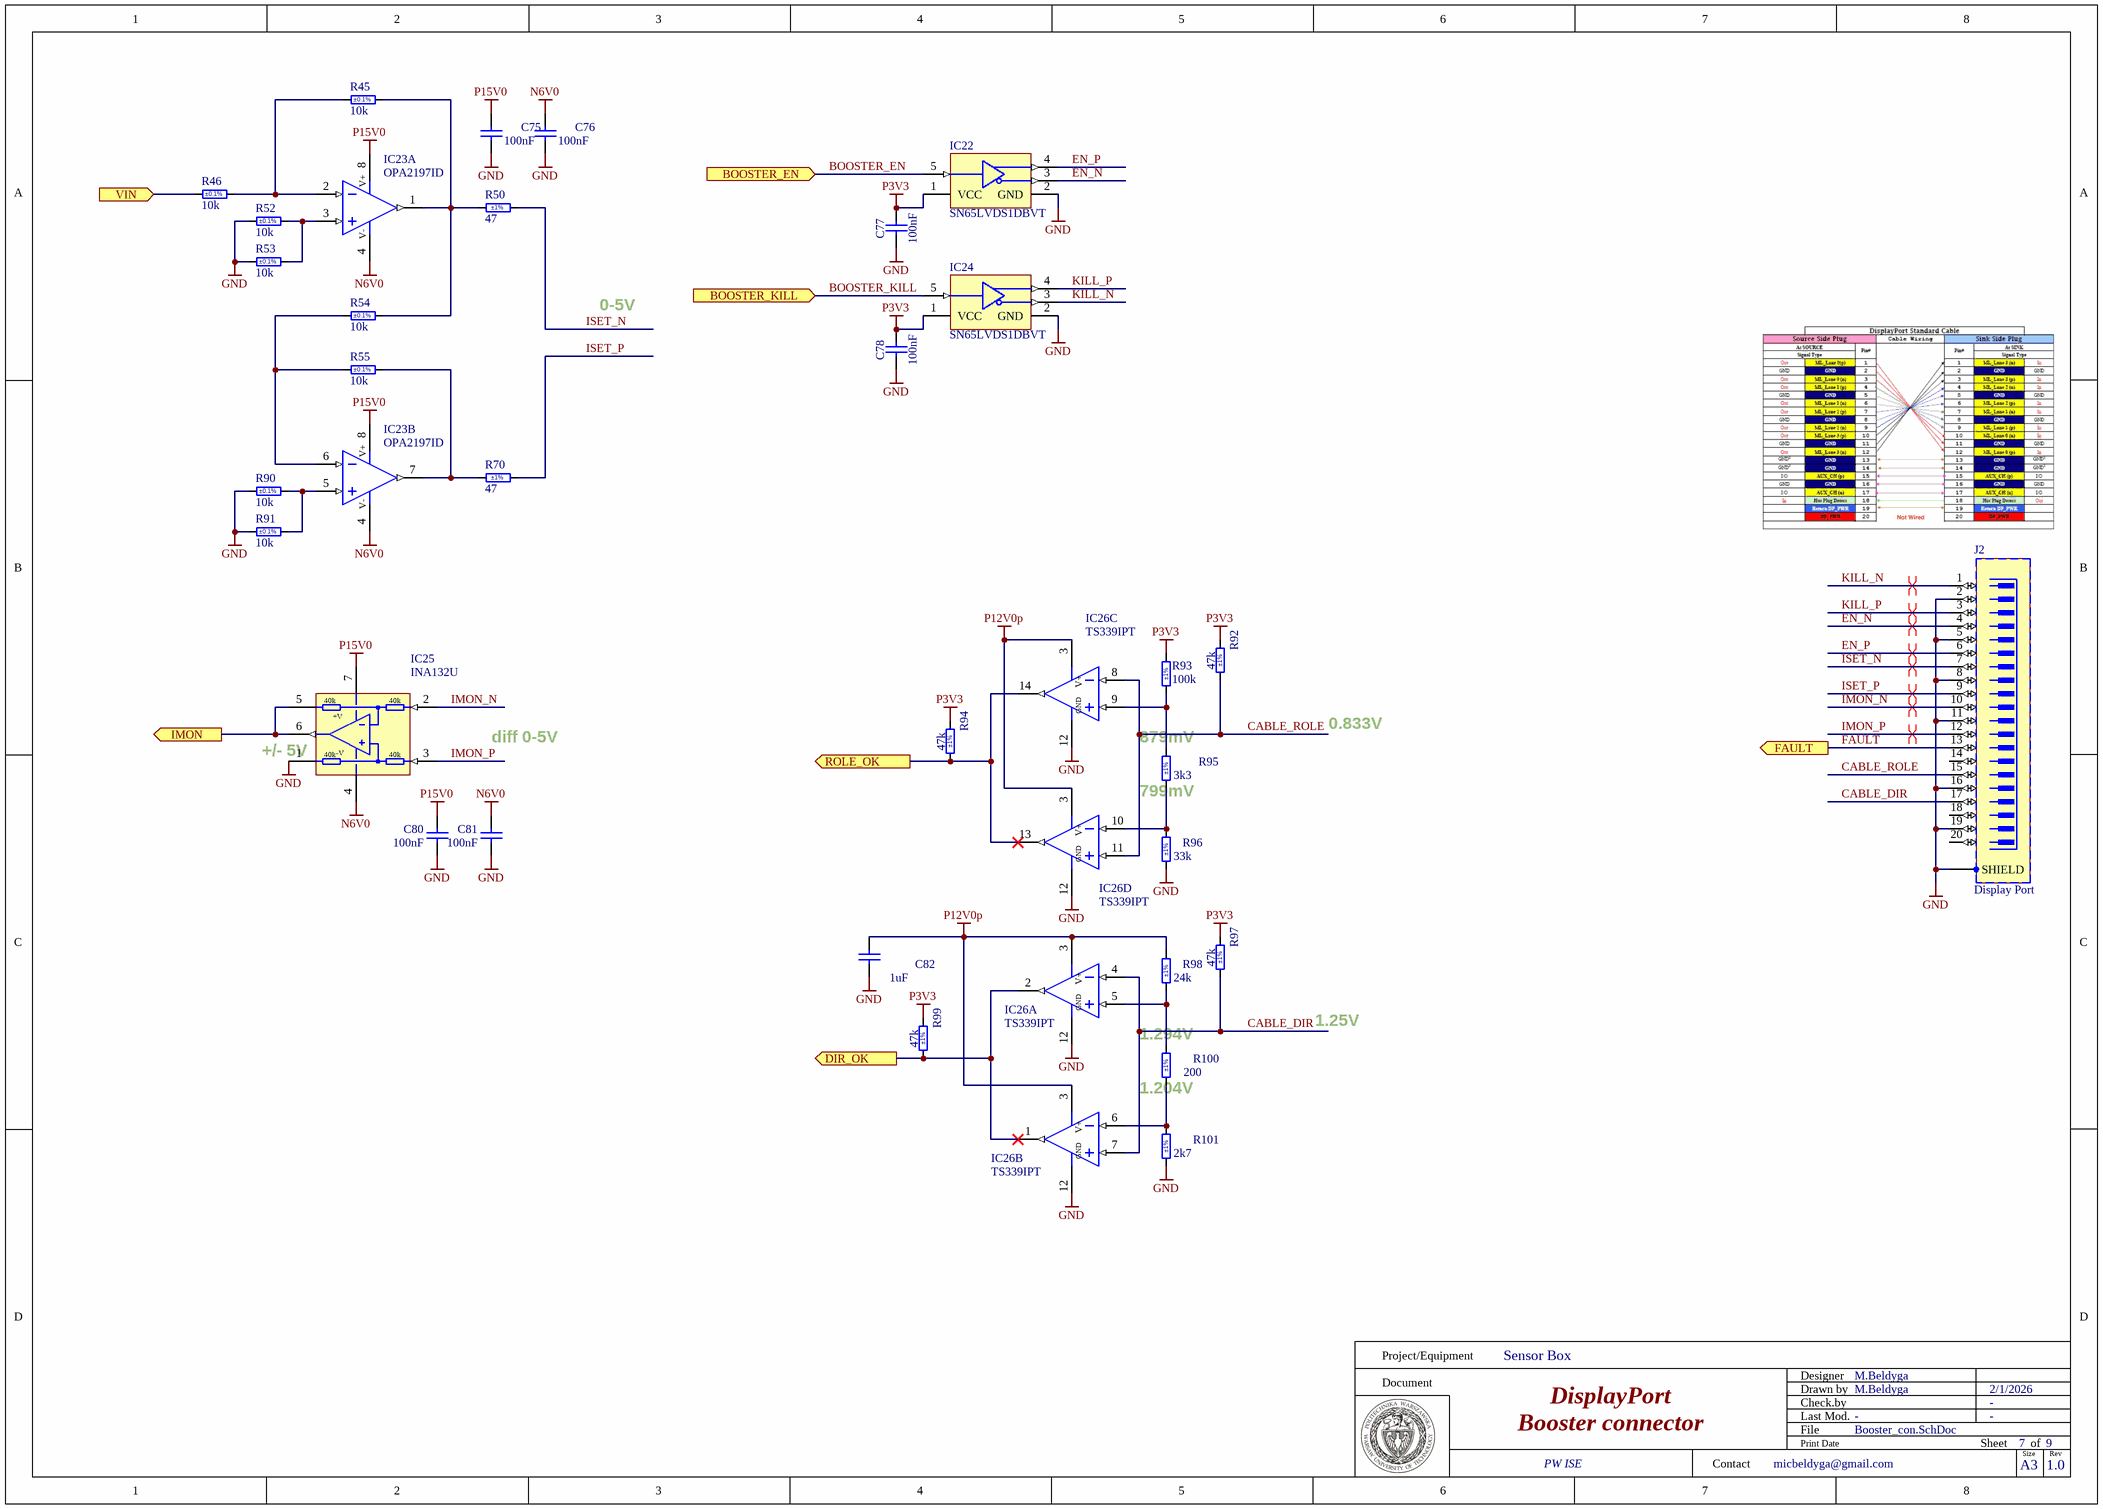
[diagram p6: Booster_con.SchDoc]

### Parts
C75  100nF  [CAPC1005X55N]
C76  100nF  [CAPC1005X55N]
C77  100nF  [CAPC1005X55N]
C78  100nF  [CAPC1005X55N]
C80  100nF  [CAPC1005X55N]
C81  100nF  [CAPC1005X55N]
C82  1uF  [CAPC1005X55N]
IC22  SN65LVDS1DBVT  [SOT95P280X145-5N]
IC23  OPA2197ID  [SOIC127P600X175-8N]  (parts A,B of 2)
IC24  SN65LVDS1DBVT  [SOT95P280X145-5N]
IC25  INA132U  [SOIC127P600X175-8N]
IC26  TS339IPT  [SOP65P640X120-14N]  (parts A,B,C,D of 4)
J2  Display Port  [MOLEX_47272-0001]
R45  10k  Tolerance: ±0.1%  [RESC1005X35N]
R46  10k  Tolerance: ±0.1%  [RESC1005X35N]
R50  47  Tolerance: ±1%  [RESC1005X40N]
R52  10k  Tolerance: ±0.1%  [RESC1005X35N]
R53  10k  Tolerance: ±0.1%  [RESC1005X35N]
R54  10k  Tolerance: ±0.1%  [RESC1005X35N]
R55  10k  Tolerance: ±0.1%  [RESC1005X35N]
R70  47  Tolerance: ±1%  [RESC1005X40N]
R90  10k  Tolerance: ±0.1%  [RESC1005X35N]
R91  10k  Tolerance: ±0.1%  [RESC1005X35N]
R92  47k  Tolerance: ±1%  [RESC1005X40N]
R93  100k  Tolerance: ±1%  [RESC1005X40N]
R94  47k  Tolerance: ±1%  [RESC1005X40N]
R95  3k3  Tolerance: ±1%  [RESC1005X40N]
R96  33k  Tolerance: ±1%  [RESC1005X40N]
R97  47k  Tolerance: ±1%  [RESC1005X40N]
R98  24k  Tolerance: ±1%  [RESC1005X40N]
R99  47k  Tolerance: ±1%  [RESC1005X40N]
R100  200  Tolerance: ±1%  [RESC1608X55N]
R101  2k7  Tolerance: ±1%  [RESC1005X40N]

### Ports
BOOSTER_EN (in), BOOSTER_KILL (in), DIR_OK (out), FAULT (out), IMON (out), ROLE_OK (out), VIN (in)

### Nets
GND: C75.1 C76.1 C77.1 C78.1 C80.1 C81.1 C82.1 IC22.2(GND) IC24.2(GND) IC25.1(REF) IC26.12(GND) J2.2 J2.5 J2.8 J2.11 J2.16 J2.19 J2.SHIELD R52.1 R53.1 R90.1 R91.1 R96.1 R101.1
N6V0: C76.2 C81.2 IC23.4(V-) IC25.4(-VEE)
P3V3: C77.2 C78.2 IC22.1(VCC) IC24.1(VCC) R92.2 R93.2 R94.2 R97.2 R99.2
P12V0p: C82.2 IC26.3(V+) R98.2
P15V0: C75.2 C80.2 IC23.8(V+) IC25.7(+VCC)
BOOSTER_EN: IC22.5(R) ; port BOOSTER_EN
BOOSTER_KILL: IC24.5(R) ; port BOOSTER_KILL
CABLE_DIR: IC26.4(IN-) IC26.7(IN+) J2.17 R97.1
CABLE_ROLE: IC26.8(IN-) IC26.11(IN+) J2.15 R92.1
DIR_OK: IC26.1(OUT) IC26.2(OUT) R99.1 ; port DIR_OK
EN_N: IC22.3(A) J2.4
EN_P: IC22.4(B) J2.6
FAULT: J2.13 ; port FAULT
IMON: IC25.5(SENS) IC25.6(OUT) ; port IMON
IMON_N: IC25.2(IN-) J2.10
IMON_P: IC25.3(IN+) J2.12
ISET_N: J2.7 R50.2
ISET_P: J2.9 R70.2
KILL_N: IC24.3(A) J2.1
KILL_P: IC24.4(B) J2.3
ROLE_OK: IC26.13(OUT) IC26.14(OUT) R94.1 ; port ROLE_OK
VIN: R46.1 ; port VIN
NetIC23_1: IC23.1(OUT) R45.1 R50.1 R54.2
NetIC23_2: IC23.2(IN-) R45.2 R46.2
NetIC23_3: IC23.3(IN+) R52.2 R53.2
NetIC23_5: IC23.5(IN+) R90.2 R91.2
NetIC23_6: IC23.6(IN-) R54.1 R55.2
NetIC23_7: IC23.7(OUT) R55.1 R70.1
NetIC26_5: IC26.5(IN+) R98.1 R100.2
NetIC26_6: IC26.6(IN-) R100.1 R101.2
NetIC26_9: IC26.9(IN+) R93.1 R95.2
NetIC26_10: IC26.10(IN-) R95.1 R96.2

Not connected (* = marked no-connect by the designer): J2 14 18 20

### Channels
U_Booster_con: designators end in A; ports BOOSTER_EN=BOOSTER_EN BOOSTER_KILL=BOOSTER_KILL DIR_OK=CH0_DIR_OK FAULT=CH0_BOOST_FLT IMON=CH0_ADC_I_EXT ROLE_OK=CH0_ROLE_OK VIN=NetIC3_8
U_Booster_con: designators end in B; ports BOOSTER_EN=BOOSTER_EN BOOSTER_KILL=BOOSTER_KILL DIR_OK=CH1_DIR_OK FAULT=CH1_BOOST_FLT IMON=CH1_ADC_I_EXT ROLE_OK=CH1_ROLE_OK VIN=NetIC11_8

### Layout directives
differential pair; net class Analog: IMON_N_U_Booster_con, IMON_P_U_Booster_con, ISET_N_U_Booster_con, ISET_P_U_Booster_con
differential pair; net class D100: EN_N_U_Booster_con, EN_P_U_Booster_con, KILL_N_U_Booster_con, KILL_P_U_Booster_con

### Notes on the sheet
- 0-5V
- +/- 5V
- (near IC25) diff 0-5V
- (near IC26) 879mV
- 0.833V
- (near IC26) 799mV
- (near IC26) 1.294V
- 1.25V
- (near IC26) 1.204V
- Project/Equipment
- Document
- Designer
- Drawn by
- Check.by
- Contact
- File
- Last Mod.
- Print Date
- Sheet
- Size
- A3
- of
- Rev
- (in symbol INA132U) 40k; +V; -V

### Library data of the parts
C75 C76 C80 C81 = CC0402_100NF_16V_10%_X5R: as C51-C53 on sheet Power_Stage; Part Number: CC0402_100NF_16V_10%_X5R; Component Kind: Standard; Component Type: Standard; Pin Count: 2; Value: 100nF; Status: None; Manufacturer Part Number: CC0402_100NF_16V_10%_X5R; Case: 0402; Mounted: Yes; Socket: No; SMD: Yes; Sense: No; Manufacturer1 Example: MURATA; Manufacturer1 ComponentHeight: 0.55mm; HelpURL: \\cern.ch\dfs\Applications\Altium\Datasheets\CC0402_X5R_MURATA_GRM.pdf; Author: CERN DEM JLC; CreateDate: 10.12.2013; LatestRevisionDate: 10.12.2013
C77 C78 = CC0402_100NF_16V_10%_X7R: Non-polarised capacitor; Part Description: SMD Multilayer Chip Ceramic Capacitor; Manufacturer: GENERIC; Manufacturer1 Part Number: GRM155R71C104KA88D; Voltage: 16V; TC: X7R; Tolerance: ±10%; Part Number: CC0402_100NF_16V_10%_X7R; Component Kind: Standard; Component Type: Standard; Pin Count: 2; Value: 100nF; Status: Not Recommended; Manufacturer Part Number: CC0402_100NF_16V_10%_X7R; Case: 0402; Mounted: Yes; Socket: No; SMD: Yes; Sense: No; Manufacturer1 Example: MURATA; Manufacturer1 ComponentHeight: 0.55mm; HelpURL: \\cern.ch\dfs\Applications\Altium\Datasheets\CC0402_X7R_MURATA_GRM.pdf; Author: CERN DEM JLC; CreateDate: 05.12.2013; LatestRevisionDate: 03.12.2007
C82 = CC0402_1UF_16V_10%_X5R: Non-polarised capacitor; Part Description: SMD Multilayer Chip Ceramic Capacitor; Manufacturer: GENERIC; Manufacturer1 Part Number: C1005X5R1C105KT; Voltage: 16V; TC: X5R; Tolerance: ±10%; Part Number: CC0402_1UF_16V_10%_X5R; Component Kind: Standard; Component Type: Standard; Pin Count: 2; Value: 1uF; Status: Preferred; Manufacturer Part Number: CC0402_1UF_16V_10%_X5R; Case: 0402; Mounted: Yes; Socket: No; SMD: Yes; Sense: No; Manufacturer1 Example: TDK; Manufacturer1 ComponentHeight: 0.55mm; HelpURL: \\cern.ch\dfs\Applications\Altium\Datasheets\CC0402_X5R_TDK_C.pdf; Author: CERN DEM JLC; CreateDate: 25.10.2012; LatestRevisionDate: 25.10.2012
IC22 IC24 = SN65LVDS1DBVT: High-Speed Differential Line Driver; Manufacturer: TEXAS INSTRUMENTS; PressFit: No; Bonding: No; Part Number: SN65LVDS1DBVT; Component Kind: Standard; Component Type: Standard; Device: SN65LVDS1DBVT; PackageDescription: SOT, 0.95mm Pitch; 5 Pin, 1.60mm W X 2.90mm L X 1.45mm H body, IPC Medium Density; Part Description: High-Speed Differential Line Driver; Manufacturer Part Number: SN65LVDS1DBV; Pin Count: 5; Case: SOT23-5; Mounted: Yes; Socket: No; SMD: Yes; Sense: No; ComponentHeight: 1.45mm; Author: CERN DEM JLC; HelpURL: \\cern.ch\dfs\Applications\Altium\Datasheets\SN65LVDS1DBVT.pdf; CreateDate: 9/22/2011; LatestRevisionDate: 6/10/2022
IC23 = OPA2197ID: Dual Operational Amplifier; Part Description: Dual, 36-V, Precision, Rail-to-Rail Input/Output, Low Offset Voltage, Operational Amplifiers; Manufacturer: TEXAS INSTRUMENTS; PressFit: No; Bonding: No; Part Number: OPA2197ID; Component Kind: Standard; Component Type: Standard; Device: OPA2197ID; PackageDescription: SOIC 8, Pitch 1.27mm - Body 4x5mm, IPC Medium Density; Manufacturer Part Number: OPA2197ID; Pin Count: 8; Case: SOIC8; Mounted: Yes; Socket: No; SMD: Yes; Sense: No; ComponentHeight: 1.75mm; Author: CERN DEM MR; HelpURL: \\cern.ch\dfs\Applications\Altium\Datasheets\OPA2197ID.pdf; CreateDate: 8/7/2019; LatestRevisionDate: 8/7/2019
IC25 = INA132U: High-Speed, Precision Difference Amplifier; Manufacturer: TEXAS INSTRUMENTS; PressFit: No; Bonding: No; Part Number: INA132U; Component Kind: Standard; Component Type: Standard; Device: INA132U; PackageDescription: SOIC 8, Pitch 1.27mm, Body 4x5mm, IPC Medium Density; Part Description: High-Speed, Precision Difference Amplifier; Manufacturer Part Number: INA132U; Pin Count: 7; Case: SOIC8; Mounted: Yes; Socket: No; SMD: Yes; Sense: No; ComponentHeight: 1.75mm; Author: CERN DEM JLC; HelpURL: \\cern.ch\dfs\Applications\Altium\Datasheets\INA132U.pdf; CreateDate: 3/11/2015; LatestRevisionDate: 3/11/2015
IC26 = CMP_TS339: Quad comparator; Part Description: Ultra-Low Power Quad Comparator; Manufacturer: ST; PressFit: No; Bonding: No; Part Number: TS339IPT; Component Kind: Standard; Component Type: Standard; Device: TS339IPT; PackageDescription: SOP, 14-Leads, Body 5.1x4.5mm (max), Pitch 0.65mm, IPC Medium Density; Manufacturer Part Number: TS339IPT; Pin Count: 14; Case: TSSOP14; Mounted: Yes; Socket: No; SMD: Yes; Sense: No; ComponentHeight: 1.75mm; Author: GK; HelpURL: \\cern.ch\dfs\Applications\Altium\Datasheets\LP339M-NOPB.pdf; CreateDate: 23.03.2016; LatestRevisionDate: 23.03.2016
J2 = MOLEX_47272-0001: Connector Mini DisplayPort 20 Male + 1 Shield; Part Description: 20 Circuits, 0.50mm Pitch, Right Angle DisplayPort Male Receptacle; Manufacturer: MOLEX; PressFit: No; Part Number: MOLEX_47272-0001; Component Kind: Standard; Component Type: Standard; Pin Count: 21; Family: Display Port; Mounted: Yes; Socket: No; SMD: Yes; Sense: No; Status: None; Manufacturer Part Number: 47272-0001; ComponentHeight: 5.63mm; HelpURL: \\cern.ch\dfs\Applications\Altium\Datasheets\MOLEX_47272-0001.pdf; Author: CERN DEM JLC; CreateDate: 2/5/2015; LatestRevisionDate: 2/5/2015
R45 R46 R52-R55 R90 R91 = R0402_10K_0.1%_0.063W_25PPM: as R81 on sheet Power_Stage; Part Number: R0402_10K_0.1%_0.063W_25PPM; Component Kind: Standard; Component Type: Standard; Pin Count: 2; Value: 10k; Status: Not Recommended; Manufacturer Part Number: R0402_10K_0.1%_0.063W_25PPM; Case: 0402; Mounted: Yes; Sense: No; Socket: No; SMD: Yes; Manufacturer1 Example: TE CONNECTIVITY; Manufacturer1 ComponentHeight: 0.35mm; HelpURL: \\cern.ch\dfs\Applications\Altium\Datasheets\R0402_TYCO_CPF.pdf; Author: CERN DEM JMW; CreateDate: 9/22/2015; LatestRevisionDate: 9/22/2015
R50 R70 = R0402_47R_1%_0.0625W_100PPM: Resistor - 1%; Part Description: General Purpose Thick Film Chip Resistor; Manufacturer: GENERIC; Manufacturer1 Part Number: 232270674709L; TC: ±100ppm/°C; PressFit: No; Part Number: R0402_47R_1%_0.0625W_100PPM; Component Kind: Standard; Component Type: Standard; Pin Count: 2; Value: 47; Status: Not Recommended; Power: 0.0625W; Manufacturer Part Number: R0402_47R_1%_0.0625W_100PPM; Case: 0402; Mounted: Yes; Sense: No; Socket: No; SMD: Yes; Manufacturer1 Example: YAGEO PHYCOMP; Manufacturer1 ComponentHeight: 0.4mm; HelpURL: \\cern.ch\dfs\Applications\Altium\Datasheets\R0402_Phycomp_RC0402.pdf; Author: CERN DEM JLC; CreateDate: 12/3/2007; LatestRevisionDate: 10/17/2012
R92 R94 R97 R99 = R0402_47K_1%_0.0625W_100PPM: Resistor - 1%; Part Description: General Purpose Thick Film Chip Resistor; Manufacturer: GENERIC; Manufacturer1 Part Number: 232270674703L; TC: ±100ppm/°C; PressFit: No; Part Number: R0402_47K_1%_0.0625W_100PPM; Component Kind: Standard; Component Type: Standard; Pin Count: 2; Value: 47k; Status: Not Recommended; Power: 0.0625W; Manufacturer Part Number: R0402_47K_1%_0.0625W_100PPM; Case: 0402; Mounted: Yes; Sense: No; Socket: No; SMD: Yes; Manufacturer1 Example: YAGEO PHYCOMP; Manufacturer1 ComponentHeight: 0.4mm; HelpURL: \\cern.ch\dfs\Applications\Altium\Datasheets\R0402_Phycomp_RC0402.pdf; Author: CERN DEM JLC; CreateDate: 03.12.2007; LatestRevisionDate: 17.10.2012
R93 = R0402_100K_1%_0.0625W_100PPM: Resistor - 1%; Part Description: General Purpose Thick Film Chip Resistor; Manufacturer: GENERIC; Manufacturer1 Part Number: 232270671004L; TC: ±100ppm/°C; PressFit: No; Part Number: R0402_100K_1%_0.0625W_100PPM; Component Kind: Standard; Component Type: Standard; Pin Count: 2; Value: 100k; Status: Not Recommended; Power: 0.0625W; Manufacturer Part Number: R0402_100K_1%_0.0625W_100PPM; Case: 0402; Mounted: Yes; Sense: No; Socket: No; SMD: Yes; Manufacturer1 Example: YAGEO PHYCOMP; Manufacturer1 ComponentHeight: 0.4mm; HelpURL: \\cern.ch\dfs\Applications\Altium\Datasheets\R0402_Phycomp_RC0402.pdf; Author: CERN DEM JLC; CreateDate: 12/3/2007; LatestRevisionDate: 10/17/2012
R95 = R0402_3K3_1%_0.0625W_100PPM: Resistor - 1%; Part Description: General Purpose Thick Film Chip Resistor; Manufacturer: GENERIC; Manufacturer1 Part Number: 232270673302L; TC: ±100ppm/°C; PressFit: No; Part Number: R0402_3K3_1%_0.0625W_100PPM; Component Kind: Standard; Component Type: Standard; Pin Count: 2; Value: 3k3; Status: Not Recommended; Power: 0.0625W; Manufacturer Part Number: R0402_3K3_1%_0.0625W_100PPM; Case: 0402; Mounted: Yes; Sense: No; Socket: No; SMD: Yes; Manufacturer1 Example: YAGEO PHYCOMP; Manufacturer1 ComponentHeight: 0.4mm; HelpURL: \\cern.ch\dfs\Applications\Altium\Datasheets\R0402_Phycomp_RC0402.pdf; Author: CERN DEM JLC; CreateDate: 03.12.2007; LatestRevisionDate: 17.10.2012
R96 = R0402_33K_1%_0.0625W_100PPM: Resistor - 1%; Part Description: General Purpose Thick Film Chip Resistor; Manufacturer: GENERIC; Manufacturer1 Part Number: 232270673303L; TC: ±100ppm/°C; PressFit: No; Part Number: R0402_33K_1%_0.0625W_100PPM; Component Kind: Standard; Component Type: Standard; Pin Count: 2; Value: 33k; Status: Not Recommended; Power: 0.0625W; Manufacturer Part Number: R0402_33K_1%_0.0625W_100PPM; Case: 0402; Mounted: Yes; Sense: No; Socket: No; SMD: Yes; Manufacturer1 ComponentHeight: 0.4mm; HelpURL: \\cern.ch\dfs\Applications\Altium\Datasheets\R0402_Phycomp_RC0402.pdf; Author: CERN DEM JLC; CreateDate: 12/3/2007; LatestRevisionDate: 10/17/2012; Manufacturer1 Example: YAGEO PHYCOMP
R98 = R0402_24K_1%_0.0625W_100PPM: Resistor - 1%; Part Description: General Purpose Thick Film Chip Resistor; Manufacturer: GENERIC; Manufacturer1 Part Number: 232270672403L; TC: ±100ppm/°C; PressFit: No; Part Number: R0402_24K_1%_0.0625W_100PPM; Component Kind: Standard; Component Type: Standard; Pin Count: 2; Value: 24k; Status: Not Recommended; Power: 0.0625W; Manufacturer Part Number: R0402_24K_1%_0.0625W_100PPM; Case: 0402; Mounted: Yes; Sense: No; Socket: No; SMD: Yes; Manufacturer1 Example: YAGEO PHYCOMP; Manufacturer1 ComponentHeight: 0.4mm; HelpURL: \\cern.ch\dfs\Applications\Altium\Datasheets\R0402_Phycomp_RC0402.pdf; Author: CERN DEM JLC; CreateDate: 03.12.2007; LatestRevisionDate: 17.10.2012
R100 = R0603_200R_1%_0.1W_100PPM: as R65 on sheet Power_Stage; Part Number: R0603_200R_1%_0.1W_100PPM; Component Kind: Standard; Component Type: Standard; Pin Count: 2; Value: 200; Status: Preferred; Manufacturer Part Number: R0603_200R_1%_0.1W_100PPM; Case: 0603; Mounted: Yes; Sense: No; Socket: No; SMD: Yes; Manufacturer1 ComponentHeight: 0.55mm; HelpURL: \\cern.ch\dfs\Applications\Altium\Datasheets\R0603_NIC_NRC.pdf; Author: CERN DEM JLC; CreateDate: 03.12.2007; LatestRevisionDate: 13.03.2008
R101 = R0402_2K7_1%_0.0625W_100PPM: Resistor - 1%; Part Description: General Purpose Thick Film Chip Resistor; Manufacturer: GENERIC; Manufacturer1 Part Number: RC0402FR-072K7L; TC: ±200ppm/°C; PressFit: No; Part Number: R0402_2K7_1%_0.0625W_100PPM; Component Kind: Standard; Component Type: Standard; Pin Count: 2; Value: 2k7; Status: Not Recommended; Power: 0.0625W; Manufacturer Part Number: R0402_2K7_1%_0.0625W_100PPM; Case: 0402; Mounted: Yes; Sense: No; Socket: No; SMD: Yes; Manufacturer1 ComponentHeight: 0.4mm; HelpURL: \\cern.ch\dfs\Applications\Altium\Datasheets\R0402_YAGEO_RC_L.pdf; Author: CERN DEM HF; CreateDate: 8/28/2024; LatestRevisionDate: 8/28/2024; Manufacturer1 Example: YAGEO PHYCOMP

## Sheet Diagnostics.SchDoc: Diagnostics
size A3; Author: M.Beldyga; CompanyName: WUT ISE; DrawnBy: M.Beldyga; Organization: WUT ISE; Address1: PW ISE; Address2: Nowowiejska 15/19 00-665 Warsaw; Address3: micbeldyga@gmail.com; SheetNumber: 8; SheetTotal: 9; ModifiedBy: -; CheckedDate: -; Title2: xxx; DivGrp: WUT ISE; Designer: GK, MB; ModifiedDate: -; ProjectName: Sensor Box
Used 2 times, as channels U_Diagnostics, U_Diagnostics. Parts and nets are listed once, with the designators drawn on the sheet.
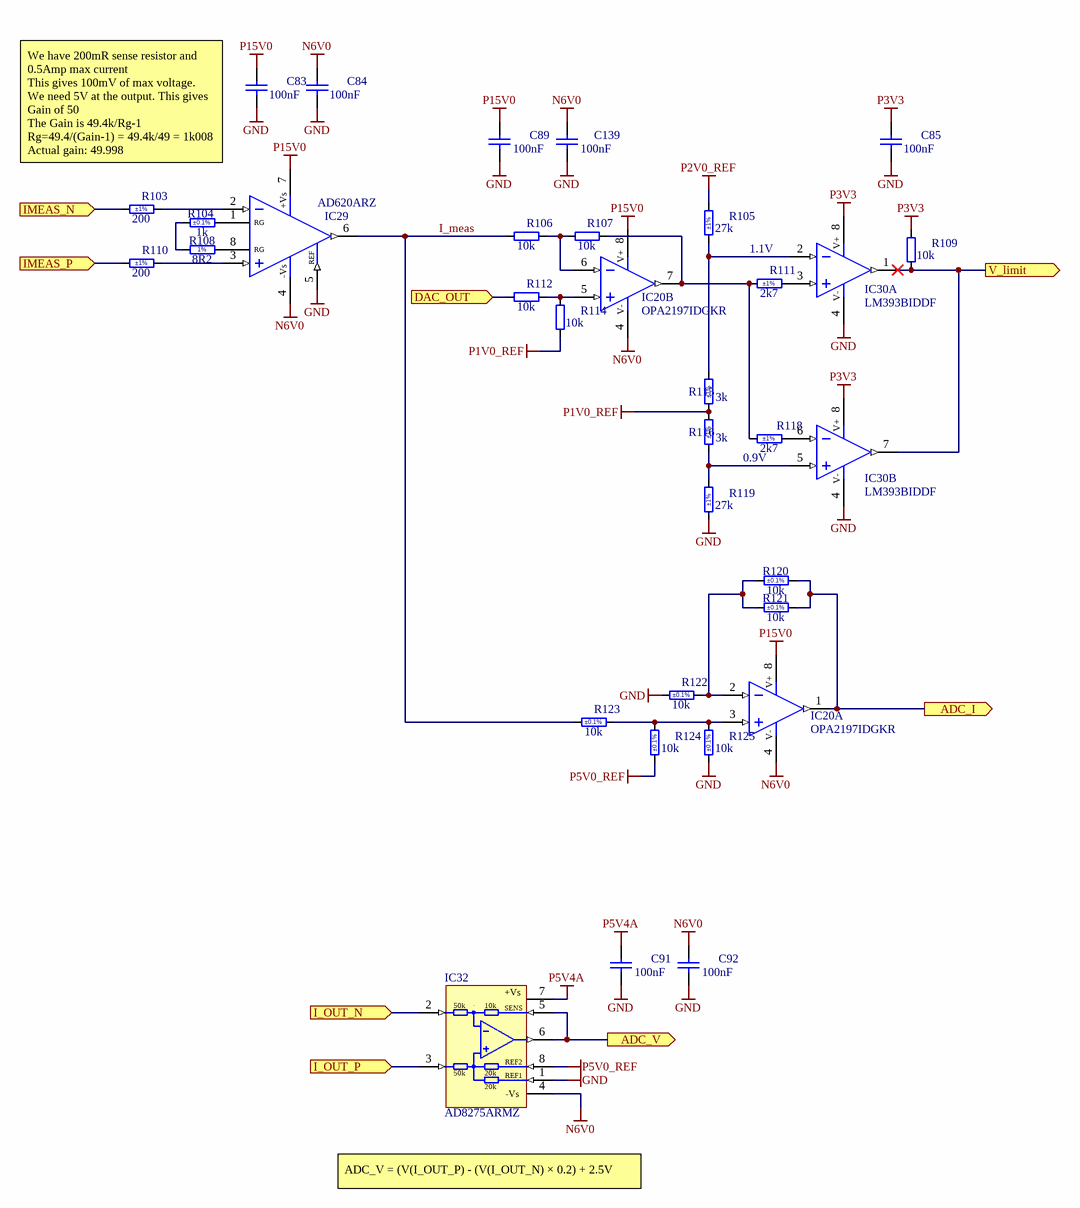
[diagram p7: Diagnostics.SchDoc]

### Parts
C83  100nF  [CAPC1005X55N]
C84  100nF  [CAPC1005X55N]
C85  100nF  [CAPC1005X55N]
C89  100nF  [CAPC1005X55N]
C91  100nF  [CAPC1005X55N]
C92  100nF  [CAPC1005X55N]
C139  100nF  [CAPC1005X55N]
IC20  OPA2197IDGKR  [SOP65P490X110-8N]  (parts A,B of 2)
IC29  AD620ARZ  [SOIC127P600X175-8N]
IC30  LM393BIDDF  [SOT65P280X110-8N]  (parts A,B of 2)
IC32  AD8275ARMZ  [SOP65P490X110-8N]
R103  200  Tolerance: ±1%  [RESC1608X55N]
R104  1k  Tolerance: ±0.1%  [RESC1005X40N]
R105  27k  Tolerance: ±1%  [RESC1005X40N]
R106  10k  [RESC1005X35N]
R107  10k  [RESC1005X35N]
R108  8R2  [RESC1608X55N]
R109  10k  [RESC1005X35N]
R110  200  Tolerance: ±1%  [RESC1608X55N]
R111  2k7  Tolerance: ±1%  [RESC1005X40N]
R112  10k  [RESC1005X35N]
R114  10k  [RESC1005X35N]
R115  3k  Tolerance: ±1%  [RESC1005X40N]
R116  3k  Tolerance: ±1%  [RESC1005X40N]
R118  2k7  Tolerance: ±1%  [RESC1005X40N]
R119  27k  Tolerance: ±1%  [RESC1005X40N]
R120  10k  Tolerance: ±0.1%  [RESC1005X35N]
R121  10k  Tolerance: ±0.1%  [RESC1005X35N]
R122  10k  Tolerance: ±0.1%  [RESC1005X35N]
R123  10k  Tolerance: ±0.1%  [RESC1005X35N]
R124  10k  Tolerance: ±0.1%  [RESC1005X35N]
R125  10k  Tolerance: ±0.1%  [RESC1005X35N]

### Ports
ADC_I (out), ADC_V (out), DAC_OUT (in), I_OUT_N (in), I_OUT_P (in), IMEAS_N (in), IMEAS_P (in), V_limit (out)

### Nets
GND: C83.1 C84.1 C85.1 C89.1 C91.1 C92.1 C139.1 IC29.5(REF) IC30.4(V-) IC32.1(REF1) R119.1 R122.1 R125.1
N6V0: C84.2 C92.2 C139.2 IC20.4(V-) IC29.4(-Vs) IC32.4(-Vs)
P1V0_REF: R114.1 R115.1 R116.2
P2V0_REF: R105.2
P3V3: C85.2 IC30.8(V+) R109.2
P5V0_REF: IC32.8(REF2) R124.1
P5V4A: C91.2 IC32.7(+Vs)
P15V0: C83.2 C89.2 IC20.8(V+) IC29.7(+Vs)
ADC_I: IC20.1(OUT) R120.2 R121.2 ; port ADC_I
ADC_V: IC32.5(SENSE) IC32.6(OUT) ; port ADC_V
DAC_OUT: R112.1 ; port DAC_OUT
I_meas: IC29.6(Vout) R106.1 R123.1
I_OUT_N: IC32.2(IN-) ; port I_OUT_N
I_OUT_P: IC32.3(IN+) ; port I_OUT_P
IMEAS_N: R103.1 ; port IMEAS_N
IMEAS_P: R110.1 ; port IMEAS_P
V_limit: IC30.1(OUT) IC30.7(OUT) R109.1 ; port V_limit
NetIC20_2: IC20.2(IN-) R120.1 R121.1 R122.2
NetIC20_3: IC20.3(IN+) R123.2 R124.2 R125.2
NetIC20_5: IC20.5(IN+) R112.2 R114.2
NetIC20_6: IC20.6(IN-) R106.2 R107.1
NetIC20_7: IC20.7(OUT) R107.2 R111.1 R118.1
NetIC29_1: IC29.1(-RG) R104.2
NetIC29_2: IC29.2(-IN) R103.2
NetIC29_3: IC29.3(+IN) R110.2
NetIC29_8: IC29.8(+RG) R108.2
NetIC30_2: IC30.2(IN-) R105.1 R115.2
NetIC30_3: IC30.3(IN+) R111.2
NetIC30_5: IC30.5(IN+) R116.1 R119.2
NetIC30_6: IC30.6(IN-) R118.2
NetR104_1: R104.1 R108.1

### Channels
U_Diagnostics: designators end in A; ports ADC_I=CH0_ADC_I_INT ADC_V=CH0_ADC_V DAC_OUT=V_CTRL I_OUT_N=CH0_OUT_N I_OUT_P=CH0_OUT_P IMEAS_N=CH0_IMEAS_N IMEAS_P=CH0_IMEAS_P V_limit=CH0_V_LIM
U_Diagnostics: designators end in B; ports ADC_I=CH1_ADC_I_INT ADC_V=CH1_ADC_V DAC_OUT=V_CTRL I_OUT_N=CH1_OUT_N I_OUT_P=CH1_OUT_P IMEAS_N=CH1_IMEAS_N IMEAS_P=CH1_IMEAS_P V_limit=CH1_V_LIM

### Notes on the sheet
- We have 200mR sense resistor and 0.5Amp max current
  This gives 100mV of max voltage.
  We need 5V at the output. This gives Gain of 50
  The Gain is 49.4k/Rg-1
  Rg=49.4/(Gain-1) = 49.4k/49 = 1k008
  Actual gain: 49.998
- 1.1V
- (near R118) 0.9V
- ADC_V = (V(I_OUT_P) - (V(I_OUT_N) × 0.2) + 2.5V
- Project/Equipment
- Document
- Designer
- Drawn by
- Check.by
- Contact
- File
- Last Mod.
- Print Date
- Sheet
- Size
- A3
- of
- Rev
- (in symbol AD620ARZ) RG
- (in symbol AD8275ARMZ) 50k; 10k; SENS; 20k
- (in symbol R0603_8R2_1%_0.1W_200PPM) 1%

### Library data of the parts
C83-C85 C89 C91 C92 C139 = CC0402_100NF_16V_10%_X5R: as C51-C53 on sheet Power_Stage; Part Number: CC0402_100NF_16V_10%_X5R; Component Kind: Standard; Component Type: Standard; Pin Count: 2; Value: 100nF; Status: None; Manufacturer Part Number: CC0402_100NF_16V_10%_X5R; Case: 0402; Mounted: Yes; Socket: No; SMD: Yes; Sense: No; Manufacturer1 Example: MURATA; Manufacturer1 ComponentHeight: 0.55mm; HelpURL: \\cern.ch\dfs\Applications\Altium\Datasheets\CC0402_X5R_MURATA_GRM.pdf; Author: CERN DEM JLC; CreateDate: 10.12.2013; LatestRevisionDate: 10.12.2013
IC20 = OA_OPA2197IDGKR: as IC17 on sheet Power_Stage; Part Number: OPA2197IDGKR; Component Kind: Standard; Component Type: Standard; Device: OPA2197IDGKR; PackageDescription: SOP, 0.65mm pitch; 8 pin, 3.00mm W X 3.00mm L X 1.10mm H body, IPC Medium Density; Manufacturer1 Part Number: OPA2197IDGKR; Pin Count: 8; Case: MSOP8; Mounted: Yes; Socket: No; SMD: Yes; Sense: No; ComponentHeight: 1.1mm; Author: GK; HelpURL: \\cern.ch\dfs\Applications\Altium\Datasheets\OPA2140AIDGK.pdf; CreateDate: 20.04.2017; LatestRevisionDate: 20.04.2017
IC29 = AD620ARZ: Low Cost Low Power Instrumentation Amplifier; Manufacturer1: ANALOG DEVICES; Manufacturer1 Part Number: AD620ARZ-REEL7; PressFit: No; Bonding: No; Part Number: AD620ARZ; Component Kind: Standard; Component Type: Standard; Device: AD620ARZ; PackageDescription: SOIC 8, Pitch 1.27mm - Body 4x5mm, IPC Medium Density; Part Description: Low Cost Low Power Instrumentation Amplifier; Pin Count: 8; Case: SOIC8; Mounted: Yes; Socket: No; SMD: Yes; Sense: No; ComponentHeight: 1.75mm; Author: CERN DEM JLC; HelpURL: \\cern.ch\dfs\Applications\Altium\Datasheets\AD620ARZ.pdf; CreateDate: 13.02.2017; LatestRevisionDate: 29.03.2022
IC30 = LM393BIDDF: Dual Operational Amplifier; Part Description: Dual Commercial Grade Standard Comparator; Manufacturer: TEXAS INSTRUMENTS; PressFit: No; Bonding: No; Part Number: LM393BIDDF; Component Kind: Standard; Component Type: Standard; Device: LM393BIDDF; PackageDescription: SOT, 0.65mm pitch; 8 Pin, 1.625mm W X 2.90mm L X 1.10mm H body, IPC Medium Density; Manufacturer Part Number: LM393BIDDF; Pin Count: 8; Case: SOT23-8; Mounted: Yes; Socket: No; SMD: Yes; Sense: No; ComponentHeight: 1.1mm; Author: CERN DEM HF; HelpURL: \\cern.ch\dfs\Applications\Altium\Datasheets\LM393B.pdf; CreateDate: 3/17/2023; LatestRevisionDate: 3/17/2023
IC32 = AD8275ARMZ: G = 0.2, Level Translation, 16-Bit ADC Driver; Manufacturer: ANALOG DEVICES; PressFit: No; Bonding: No; Part Number: AD8275ARMZ; Component Kind: Standard; Component Type: Standard; Device: AD8275ARMZ; PackageDescription: SOP, 0.65mm Pitch; 8 Pin, 3.00mm W X 3.00mm L X 1.10mm H body, IPC Medium Density; Part Description: G = 0.2, Level Translation, 16-Bit ADC Driver; Manufacturer Part Number: AD8275ARM; Pin Count: 8; Case: MSOP8; Mounted: Yes; Socket: No; SMD: Yes; Sense: No; ComponentHeight: 1.1mm; Author: CERN DEM JLC; HelpURL: \\cern.ch\dfs\Applications\Altium\Datasheets\AD8275ARMZ.pdf; CreateDate: 10/29/2012; LatestRevisionDate: 3/29/2022
R103 R110 = R0603_200R_1%_0.1W_100PPM: as R65 on sheet Power_Stage; Part Number: R0603_200R_1%_0.1W_100PPM; Component Kind: Standard; Component Type: Standard; Pin Count: 2; Value: 200; Status: Preferred; Manufacturer Part Number: R0603_200R_1%_0.1W_100PPM; Case: 0603; Mounted: Yes; Sense: No; Socket: No; SMD: Yes; Manufacturer1 ComponentHeight: 0.55mm; HelpURL: \\cern.ch\dfs\Applications\Altium\Datasheets\R0603_NIC_NRC.pdf; Author: CERN DEM JLC; CreateDate: 03.12.2007; LatestRevisionDate: 13.03.2008
R104 = R0402_1K_0.1%_0.063W_25PPM: as R67 on sheet Power_Stage; Part Number: R0402_1K_0.1%_0.063W_25PPM; Component Kind: Standard; Component Type: Standard; Pin Count: 2; Value: 1k; Status: Not Recommended; Manufacturer Part Number: R0402_1K_0.1%_0.063W_25PPM; Case: 0402; Mounted: Yes; Sense: No; Socket: No; SMD: Yes; Manufacturer1 ComponentHeight: 0.4mm; HelpURL: \\cern.ch\dfs\Applications\Altium\Datasheets\R0402_PANASONIC_ERA.pdf; Author: CERN DEM BC; CreateDate: 7/10/2020; LatestRevisionDate: 7/10/2020; Manufacturer1 Example: PANASONIC
R105 R119 = R0402_27K_1%_0.0625W_100PPM: Resistor - 1%; Part Description: General Purpose Thick Film Chip Resistor; Manufacturer: GENERIC; Manufacturer1 Part Number: 232270672703L; TC: ±100ppm/°C; PressFit: No; Part Number: R0402_27K_1%_0.0625W_100PPM; Component Kind: Standard; Component Type: Standard; Pin Count: 2; Value: 27k; Status: Not Recommended; Power: 0.0625W; Manufacturer Part Number: R0402_27K_1%_0.0625W_100PPM; Case: 0402; Mounted: Yes; Sense: No; Socket: No; SMD: Yes; Manufacturer1 ComponentHeight: 0.4mm; HelpURL: \\cern.ch\dfs\Applications\Altium\Datasheets\R0402_Phycomp_RC0402.pdf; Author: CERN DEM JLC; CreateDate: 12/3/2007; LatestRevisionDate: 10/17/2012; Manufacturer1 Example: YAGEO PHYCOMP
R106 R107 R109 R112 R114 R120-R125 = R0402_10K_0.1%_0.063W_25PPM: as R81 on sheet Power_Stage; Part Number: R0402_10K_0.1%_0.063W_25PPM; Component Kind: Standard; Component Type: Standard; Pin Count: 2; Value: 10k; Status: Not Recommended; Manufacturer Part Number: R0402_10K_0.1%_0.063W_25PPM; Case: 0402; Mounted: Yes; Sense: No; Socket: No; SMD: Yes; Manufacturer1 ComponentHeight: 0.35mm; HelpURL: \\cern.ch\dfs\Applications\Altium\Datasheets\R0402_TYCO_CPF.pdf; Author: CERN DEM JMW; CreateDate: 9/22/2015; LatestRevisionDate: 9/22/2015; Manufacturer1 Example: TE CONNECTIVITY
  R106 R107 R109 R112 R114: Tolerance: ±0.1%
R108 = R0603_8R2_1%_0.1W_200PPM: Resistor - 1%; Part Description: General Purpose Thick Film Chip Resistor; Manufacturer: GENERIC; Manufacturer1: YAGEO PHYCOMP; Manufacturer1 Part Number: RC0603FR-078R2L; Power: 0.1W; TC: ±200ppm/°C; PressFit: No; Part Number: R0603_8R2_1%_0.1W_200PPM; Component Kind: Standard; Component Type: Standard; Pin Count: 2; Value: 8R2; Status: Preferred; Tolerance: ±1%; Manufacturer Part Number: R0603_8R2_1%_0.1W_200PPM; Case: 0603; Mounted: Yes; Sense: No; Socket: No; SMD: Yes; Manufacturer1 ComponentHeight: 0.65mm; HelpURL: \\cern.ch\dfs\Applications\Altium\Datasheets\R0603_Phycomp_RC0603.pdf; Author: CERN DEM JLC; CreateDate: 03/12/2007; LatestRevisionDate: 17/10/2012
R111 R118 = R0402_2K7_1%_0.0625W_100PPM: as R101 on sheet Booster_con; Part Number: R0402_2K7_1%_0.0625W_100PPM; Component Kind: Standard; Component Type: Standard; Pin Count: 2; Value: 2k7; Status: Not Recommended; Power: 0.0625W; Manufacturer Part Number: R0402_2K7_1%_0.0625W_100PPM; Case: 0402; Mounted: Yes; Sense: No; Socket: No; SMD: Yes; Manufacturer1 ComponentHeight: 0.4mm; HelpURL: \\cern.ch\dfs\Applications\Altium\Datasheets\R0402_YAGEO_RC_L.pdf; Author: CERN DEM HF; CreateDate: 8/28/2024; LatestRevisionDate: 8/28/2024; Manufacturer1 Example: YAGEO PHYCOMP
R115 R116 = R0402_3K_1%_0.0625W_100PPM: Resistor - 1%; Part Description: General Purpose Thick Film Chip Resistor; Manufacturer: GENERIC; Manufacturer1: Vishay; Manufacturer1 Part Number: RCS04023K00FKED; TC: ±100ppm/°C; PressFit: No; Part Number: R0402_3K_1%_0.0625W_100PPM; Component Kind: Standard; Component Type: Standard; Pin Count: 2; Value: 3k; Status: Not Recommended; Power: 0.0625W; Manufacturer Part Number: R0402_3K_1%_0.0625W_100PPM; Case: 0402; Mounted: Yes; Sense: No; Socket: No; SMD: Yes; Manufacturer1 ComponentHeight: 0.4mm; HelpURL: \\cern.ch\dfs\Applications\Altium\Datasheets\R0402_Phycomp_RC0402.pdf; Author: CERN DEM JLC; CreateDate: 03.12.2007; LatestRevisionDate: 17.10.2012